# Altium project UD-CPU_DIN.PrjPcb
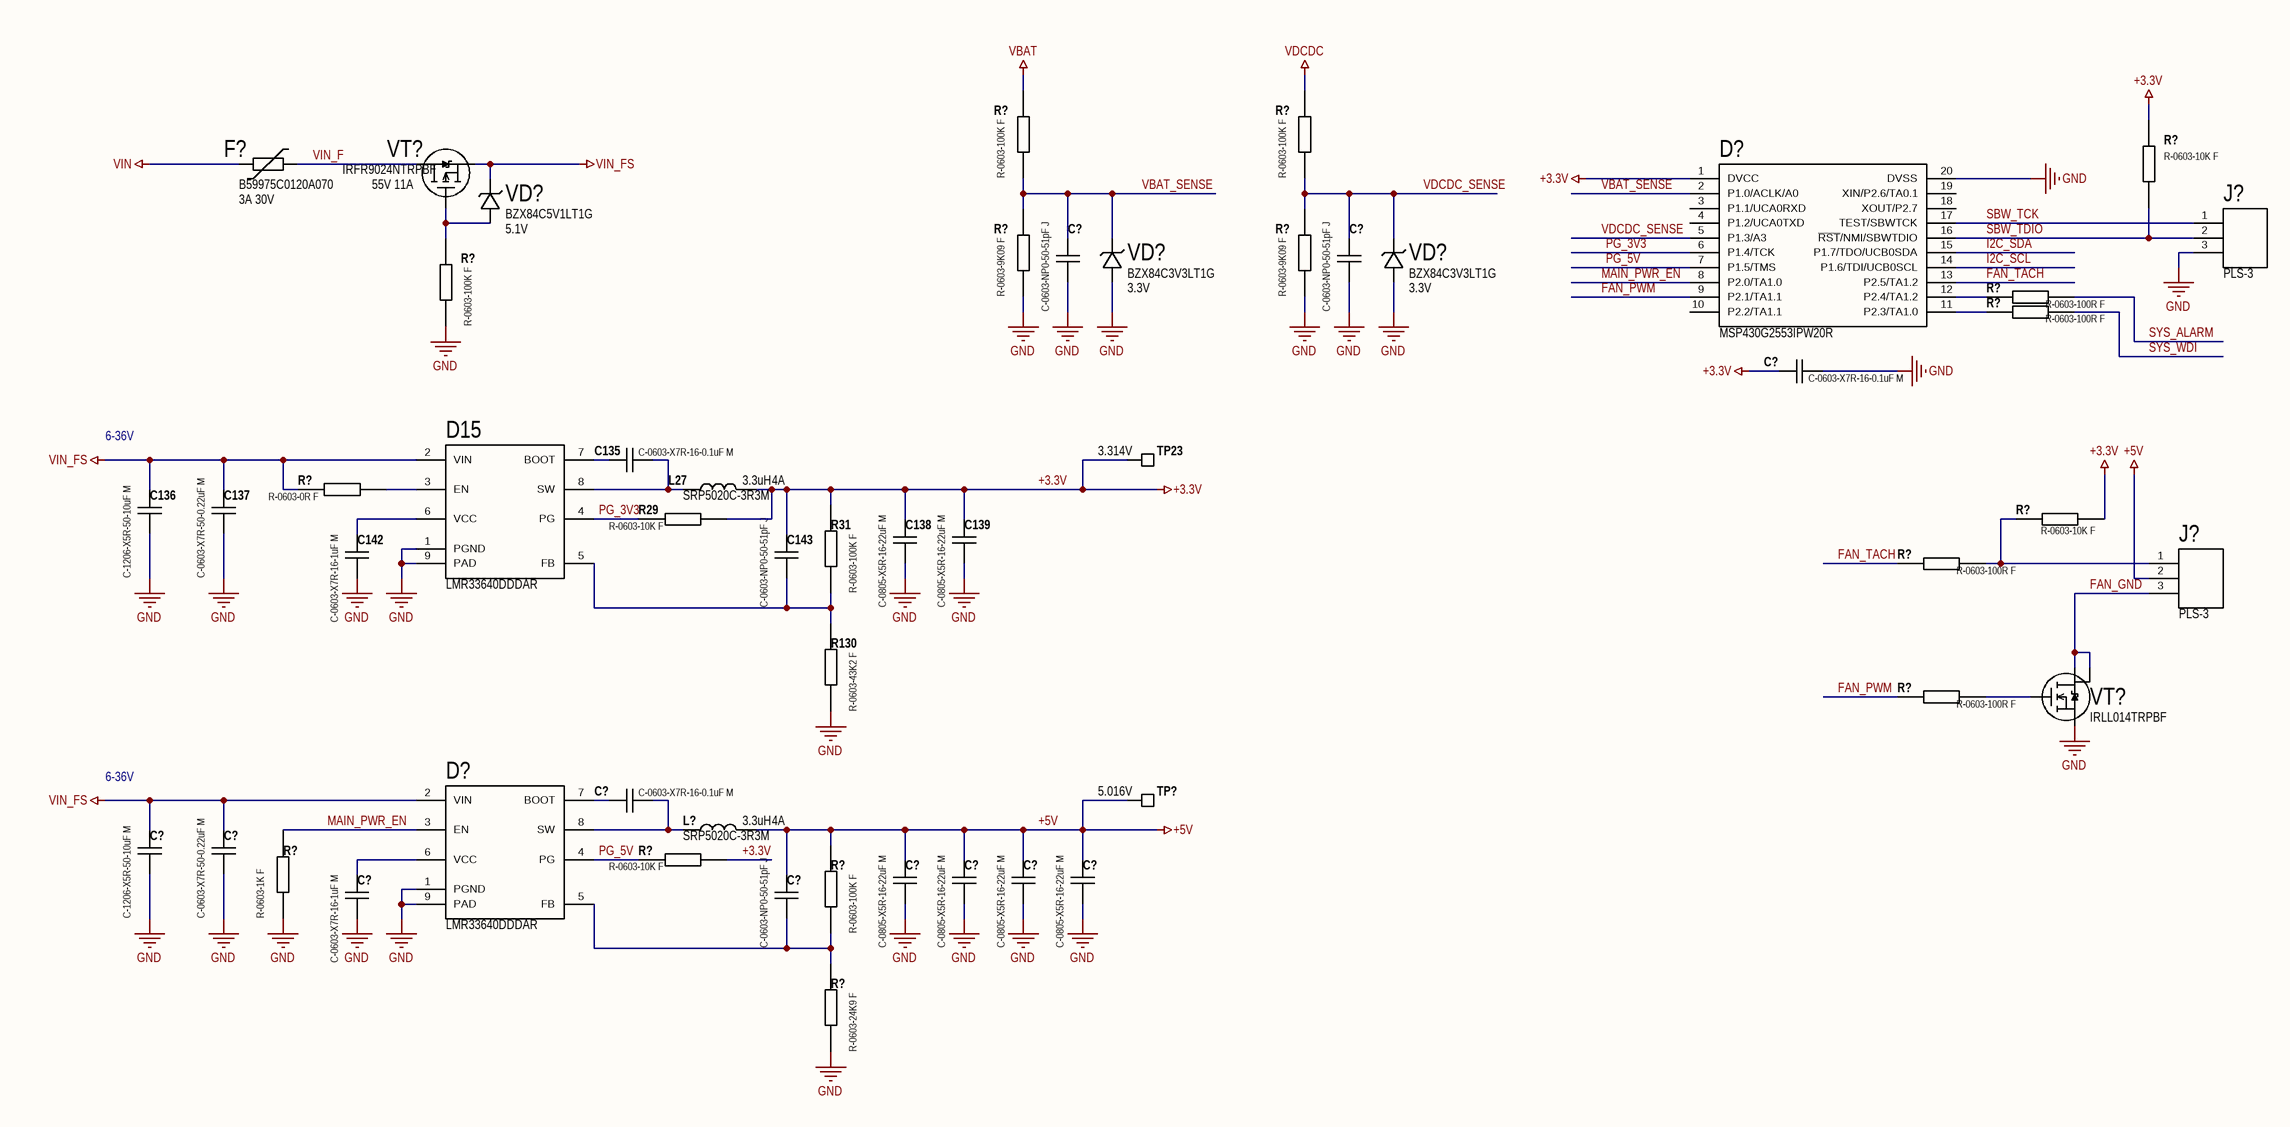
[diagram p0: 1-POWER.SchDoc]
GlobalProjectName: UD-CPU-DIN Main; GlobalProjectRevision: 2.0
4 sheets, 123 parts. Net scope: global (net labels, ports and power ports of the same name join across sheets).
Board file: CPU_DIN_boards_v1_0.PcbDoc
Sheets:
  1-POWER.SchDoc
  2-RPI.SchDoc
  3-GPIO.SchDoc
  4-RELAYS.SchDoc

## Sheet 1-POWER.SchDoc
size 420 x 297 mm; Engineer: Иванов; DocumentNumber: POWER; SheetNumber: 1; SheetTotal: 4

### Parts
(Parts that share a designator on the sheet are numbered #1, #2 ... from top to bottom, then left to right.)
C135  C-0603-X7R-16-0.1uF M  [CAPC160X80X100L35N]
C136  C-1206-X5R-50-10uF M  [CAPC320X160X180L50N]
C137  C-0603-X7R-50-0.22uF M  [CAPC160X80X100L35N]
C138  C-0805-X5R-16-22uF M  [CAPC200X125X145L50N]
C139  C-0805-X5R-16-22uF M  [CAPC200X125X145L50N]
C142  C-0603-X7R-16-1uF M  [CAPC160X80X100L35N]
C143  C-0603-NP0-50-51pF J  [CAPC160X80X100L35N]
C?#1  C-0603-NP0-50-51pF J  [CAPC160X80X100L35N]
C?#2  C-0603-NP0-50-51pF J  [CAPC160X80X100L35N]
C?#3  C-0603-X7R-16-0.1uF M  [CAPC160X80X100L35N]
C?#4  C-0603-X7R-16-0.1uF M  [CAPC160X80X100L35N]
C?#5  C-1206-X5R-50-10uF M  [CAPC320X160X180L50N]
C?#6  C-0603-X7R-50-0.22uF M  [CAPC160X80X100L35N]
C?#7  C-0805-X5R-16-22uF M  [CAPC200X125X145L50N]
C?#8  C-0805-X5R-16-22uF M  [CAPC200X125X145L50N]
C?#9  C-0805-X5R-16-22uF M  [CAPC200X125X145L50N]
C?#10  C-0805-X5R-16-22uF M  [CAPC200X125X145L50N]
C?#11  C-0603-X7R-16-1uF M  [CAPC160X80X100L35N]
C?#12  C-0603-NP0-50-51pF J  [CAPC160X80X100L35N]
D15  LMR33640DDDAR  [SOIC9P127_490X600X170L83X41T490X295]
D?#1  MSP430G2553IPW20R
D?#2  LMR33640DDDAR  [SOIC9P127_490X600X170L83X41T490X295]
F?#1  B59975C0120A070  value 3A 30V
J?#1  PLS-3  [HDRV3W63P254_3X1_762X571H1144]
J?#2  PLS-3  [HDRV3W63P254_3X1_762X571H1144]
L27  SRP5020C-3R3M  value 3.3uH  MaxCurrent: 4A  [INDDFN2_570X520X200L110X250_srp5020c]
L?  SRP5020C-3R3M  value 3.3uH  MaxCurrent: 4A  [INDDFN2_570X520X200L110X250_srp5020c]
R29  R-0603-10K F  [RESC160X80X55L30N]
R31  R-0603-100K F  [RESC160X80X55L30N]
R130  R-0603-43K2 F  [RESC160X80X55L30N]
R?#1  R-0603-100K F  [RESC160X80X55L30N]
R?#2  R-0603-100K F  [RESC160X80X55L30N]
R?#3  R-0603-10K F  [RESC160X80X55L30N]
R?#4  R-0603-9K09 F  [RESC160X80X55L30N]
R?#5  R-0603-9K09 F  [RESC160X80X55L30N]
R?#6  R-0603-100K F  [RESC160X80X55L30N]
R?#7  R-0603-100R F  [RESC160X80X55L30N]
R?#8  R-0603-100R F  [RESC160X80X55L30N]
R?#9  R-0603-0R F  [RESC160X80X55L30N]
R?#10  R-0603-10K F  [RESC160X80X55L30N]
R?#11  R-0603-100R F  [RESC160X80X55L30N]
R?#12  R-0603-100R F  [RESC160X80X55L30N]
R?#13  R-0603-1K F  [RESC160X80X55L30N]
R?#14  R-0603-100K F  [RESC160X80X55L30N]
R?#15  R-0603-10K F  [RESC160X80X55L30N]
R?#16  R-0603-24K9 F  [RESC160X80X55L30N]
TP23  Testpoint  [TP_1x1_smd]  (value not drawn)  (no BOM)
TP?  Testpoint  [TP_1x1_smd]  (value not drawn)  (no BOM)
VD?#1  BZX84C5V1LT1G  value 5.1V  [SOT23-3]
VD?#2  BZX84C3V3LT1G  value 3.3V  [SOT23-3]
VD?#3  BZX84C3V3LT1G  value 3.3V  [SOT23-3]
VT?#1  IRFR9024NTRPBF  value 55V 11A
VT?#2  IRLL014TRPBF

### Nets
+3.3V: C138.1 C139.1 C143.1 C?#3.1 D?#1.1(DVCC) L27.2 R29.1 R31.1 R?#3.1 R?#10.2 R?#15.1 TP23.1
+5V: C?#7.1 C?#8.1 C?#9.1 C?#10.1 C?#12.1 J?#2.2 L?.2 R?#14.1 TP?.1
GND: C136.2 C137.2 C138.2 C139.2 C142.2 C?#1.2 C?#2.2 C?#3.2 C?#5.2 C?#6.2 C?#7.2 C?#8.2 C?#9.2 C?#10.2 C?#11.2 D15.1(PGND) D15.9(PAD) D?#1.20(DVSS) D?#2.1(PGND) D?#2.9(PAD) J?#1.3 R130.2 R?#4.2 R?#5.2 R?#6.2 R?#13.2 R?#16.2 VD?#2.1(A) VD?#3.1(A) VT?#2.3(S)
VBAT: R?#1.1
VDCDC: R?#2.1
VIN: F?#1.1
VIN_FS: C136.1 C137.1 C?#5.1 C?#6.1 D15.2(VIN) D?#2.2(VIN) R?#9.2 VD?#1.3(C) VT?#1.3(S)
FAN_GND: J?#2.3 VT?#2.2(D) VT?#2.4(D)
FAN_PWM: D?#1.9(P2.1/TA1.1) R?#12.2
FAN_TACH: D?#1.13(P2.5/TA1.2) R?#11.2
I2C_SCL: D?#1.14(P1.6/TDI/UCB0SCL)
I2C_SDA: D?#1.15(P1.7/TDO/UCB0SDA)
MAIN_PWR_EN: D?#1.8(P2.0/TA1.0) D?#2.3(EN) R?#13.1
PG_3V3: D15.4(PG) D?#1.6(P1.4/TCK) R29.2
PG_5V: D?#1.7(P1.5/TMS) D?#2.4(PG) R?#15.2
SBW_TCK: D?#1.17(TEST/SBWTCK) J?#1.1
SBW_TDIO: D?#1.16(~{RST}/NMI/SBWTDIO) J?#1.2 R?#3.2
SYS_ALARM: R?#7.1
SYS_WDI: R?#8.1
VBAT_SENSE: C?#1.1 D?#1.2(P1.0/ACLK/A0) R?#1.2 R?#4.1 VD?#2.3(C)
VDCDC_SENSE: C?#2.1 D?#1.5(P1.3/A3) R?#2.2 R?#5.1 VD?#3.3(C)
VIN_F: F?#1.2 VT?#1.4(D)
NetC135_1: C135.1 D15.7(BOOT)
NetC135_2: C135.2 D15.8(SW) L27.1
NetC142_1: C142.1 D15.6(VCC)
NetC143_2: C143.2 D15.5(FB) R31.2 R130.1
NetC?#4_1: C?#4.1 D?#2.7(BOOT)
NetC?#4_2: C?#4.2 D?#2.8(SW) L?.1
NetC?#11_1: C?#11.1 D?#2.6(VCC)
NetC?#12_2: C?#12.2 D?#2.5(FB) R?#14.2 R?#16.1
NetD15_3: D15.3(EN) R?#9.1
NetD?#1_11: D?#1.11(P2.3/TA1.0) R?#8.2
NetD?#1_12: D?#1.12(P2.4/TA1.2) R?#7.2
NetJ?#2_1: J?#2.1 R?#10.1 R?#11.1
NetR?#6_1: R?#6.1 VD?#1.1(A) VT?#1.1(G)
NetR?#12_1: R?#12.1 VT?#2.1(G)

Not connected (* = marked no-connect by the designer): D?#1 3(P1.1/UCA0RXD) 4(P1.2/UCA0TXD) 10(P2.2/TA1.1) 18(XOUT/P2.7) 19(XIN/P2.6/TA0.1)

### Notes on the sheet
- 6-36V
- (near TP23) 3.314V
- (near TP?) 5.016V
- Подп. и дата
- Инв.№ дубл.
- Взам.инв.№
- Подп.и дата
- Инв.№ подл.
- Изм.
- Лист
- № докум.
- Подп.
- Дата
- Копировал
- Формат  A3

### Library data of the parts
C135 C?#3 C?#4 = C: General capacitor; Manufacturer: Murata; Component_Type: Конденсатор; Mount_Type: SMD; Tolerance: 20%; Voltage: 16V; Value: 0.1uF; TC: X7R; Partnumber: *; PnP_Name: C-0603-X7R-16-0.1uF M; Size: 0603; UID: C-0603-X7R-16-0.1uF M
C136 C?#5 = C: General capacitor; Manufacturer: Samsung; Partnumber: CL31A106MBHNNNE; Component_Type: Конденсатор; Mount_Type: Auto; Tolerance: 20%; Voltage: 50V; Value: 10uF; TC: X5R; PnP_Name: C-1206-X5R-50-10uF M; Size: 1206; UID: C-1206-X5R-50-10uF M
C137 C?#6 = C: General capacitor; Manufacturer: Murata; Component_Type: Конденсатор; Mount_Type: SMD; Tolerance: 20%; Voltage: 50V; Value: 0.22uF; TC: X7R; Partnumber: *; PnP_Name: C-0603-X7R-50-0.22uF M; Size: 0603; UID: C-0603-X7R-50-0.22uF M
C138 C139 C?#7-C?#10 = C: General capacitor; Manufacturer: Murata; Component_Type: Конденсатор; Mount_Type: Auto; Tolerance: 20%; Voltage: 16V; Value: 22uF; TC: X5R; Partnumber: *; PnP_Name: C-0805-X5R-16-22uF M; Size: 0805; UID: C-0805-X5R-16-22uF M
C142 C?#11 = C: General capacitor; Manufacturer: Murata; Component_Type: Конденсатор; Mount_Type: Auto; Tolerance: 20%; Voltage: 16V; Value: 1uF; TC: X7R; Partnumber: *; PnP_Name: C-0603-X7R-16-1uF M; Size: 0603; UID: C-0603-X7R-16-1uF M
C143 C?#1 C?#2 C?#12 = C: General capacitor; Manufacturer: Murata; Component_Type: Конденсатор; Mount_Type: Auto; Tolerance: 5%; Voltage: 50V; Value: 51pF; TC: NP0; Partnumber: *; PnP_Name: C-0603-NP0-50-51pF J; Size: 0603; UID: C-0603-NP0-50-51pF J
D15 D?#2 = LMR33640: Buck Switching Regulator IC Positive Adjustable 1V 1 Output 4A; Manufacturer: Texas Instruments; Component_Type: Микросхема; Mount_Type: Auto; PnP_Name: D-LMR33640DDDAR; Partnumber: LMR33640DDDAR; UID: D-LMR33640DDDAR
D?#1 = MSP430G2553IPW20R: 16-bit microcontroller; Manufacturer: Texas Instruments; Component_Type: Микросхема; Mount_Type: Auto; PnP_Name: D-MSP430G2553IPW20R; Partnumber: MSP430G2553IPW20R; UID: D-MSP430G2553IPW20R
F?#1 = R_T: Multifuse; Manufacturer: EPCOS; Mount_Type: Auto; Component_Type: Предохранитель; PnP_Name: F-B59975C0120A070; Partnumber: B59975C0120A070; Tolerance: -; Size: -; UID: F-B59975C0120A070; TC: -
J?#1 J?#2 = Conn_3: Manufacturer: KLS; Component_Type: Разъём; Mount_Type: Manual; Partnumber: PLS-3; UID: X-PLS-3
L27 L? = L: General inductor; Manufacturer: Bourns Inc.; Mount_Type: Auto; Component_Type: Дроссель; PnP_Name: L-SRP5020C-3R3M; Tolerance: 20%; DC Resistance: 74mOhm; Partnumber: SRP5020C-3R3M; Size: 5.7x5.2mm; UID: L-SRP5020C-3R3M
R29 R?#3 R?#10 R?#15 = R: General resistor; Manufacturer: Yageo; Mount_Type: Auto; Component_Type: Резистор; Tolerance: 1%; Value: 10k; Partnumber: *; Size: 0603; PnP_Name: R-0603-10K F; UID: R-0603-10K F
R31 R?#1 R?#2 R?#6 R?#14 = R: General resistor; Manufacturer: Yageo; Mount_Type: Auto; Component_Type: Резистор; Tolerance: 1%; Value: 100k; Partnumber: *; Size: 0603; PnP_Name: R-0603-100K F; UID: R-0603-100K F
R130 = R: General resistor; Manufacturer: Yageo; Mount_Type: Auto; Component_Type: Резистор; Tolerance: 1%; Value: 43.2k; Partnumber: *; Size: 0603; PnP_Name: R-0603-43K2 F; UID: R-0603-43K2 F
R?#4 R?#5 = R: General resistor; Manufacturer: Yageo; Mount_Type: Auto; Component_Type: Резистор; Tolerance: 1%; Value: 9.09k; Partnumber: *; Size: 0603; PnP_Name: R-0603-9K09 F; UID: R-0603-9K09 F
R?#7 R?#8 R?#11 R?#12 = R: General resistor; Manufacturer: Yageo; Mount_Type: SMD; Component_Type: Резистор; Value: 100; Partnumber: *; Tolerance: -; Size: 0603; PnP_Name: R-0603-100R F; UID: R-0603-100R F
R?#9 = R: General resistor; Manufacturer: Yageo; Mount_Type: SMD; Component_Type: Резистор; Value: 0; Partnumber: *; Tolerance: -; Size: 0603; PnP_Name: R-0603-0R F; UID: R-0603-0R F
R?#13 = R: General resistor; Manufacturer: Yageo; Mount_Type: Auto; Component_Type: Резистор; Tolerance: 1%; Value: 1k; Partnumber: *; Size: 0603; PnP_Name: R-0603-1K F; UID: R-0603-1K F
R?#16 = R: General resistor; Manufacturer: Yageo; Mount_Type: Auto; Component_Type: Резистор; Tolerance: 1%; Value: 24.9k; Partnumber: *; Size: 0603; PnP_Name: R-0603-24K9 F; UID: R-0603-24K9 F
TP23 TP? = Test_point: Test point
VD?#1 = BZX84C5V1LT1G: Zener Voltage Regulator (Diod); Manufacturer: ON Semiconductor; Component_Type: Транзистор; Mount_Type: Auto; PnP_Name: VD-BZX84C5V1LT1G; Partnumber: BZX84C5V1LT1G; UID: VD-BZX84C5V1LT1G
VD?#2 VD?#3 = BZX84C5V1LT1G: Zener Voltage Regulator (Diod); Manufacturer: ON Semiconductor; Component_Type: Транзистор; Mount_Type: Auto; PnP_Name: VD-BZX84C3V3LT1G; Partnumber: BZX84C3V3LT1G; UID: VD-BZX84C3V3LT1G
VT?#1 = IRFR9024: MOSFET P-CH 55V 11A DPAK; Manufacturer: Infineon Technologies; Component_Type: Транзистор; Mount_Type: Auto; PnP_Name: VT-IRFR9024NTRPBF; Partnumber: IRFR9024NTRPBF; UID: VT-IRFR9024NTRPBF
VT?#2 = IRLL014: Power N-MOSFET; Manufacturer: Vishay; Component_Type: Транзистор; Mount_Type: Auto; PnP_Name: VT-IRLL014TRPBF; Value: 60V 2.7A; Partnumber: IRLL014TRPBF; UID: VT-IRLL014TRPBF

## Sheet 2-RPI.SchDoc
size 420 x 297 mm; Engineer: Иванов; DocumentNumber: CONNECTORS; SheetNumber: 2; SheetTotal: 4
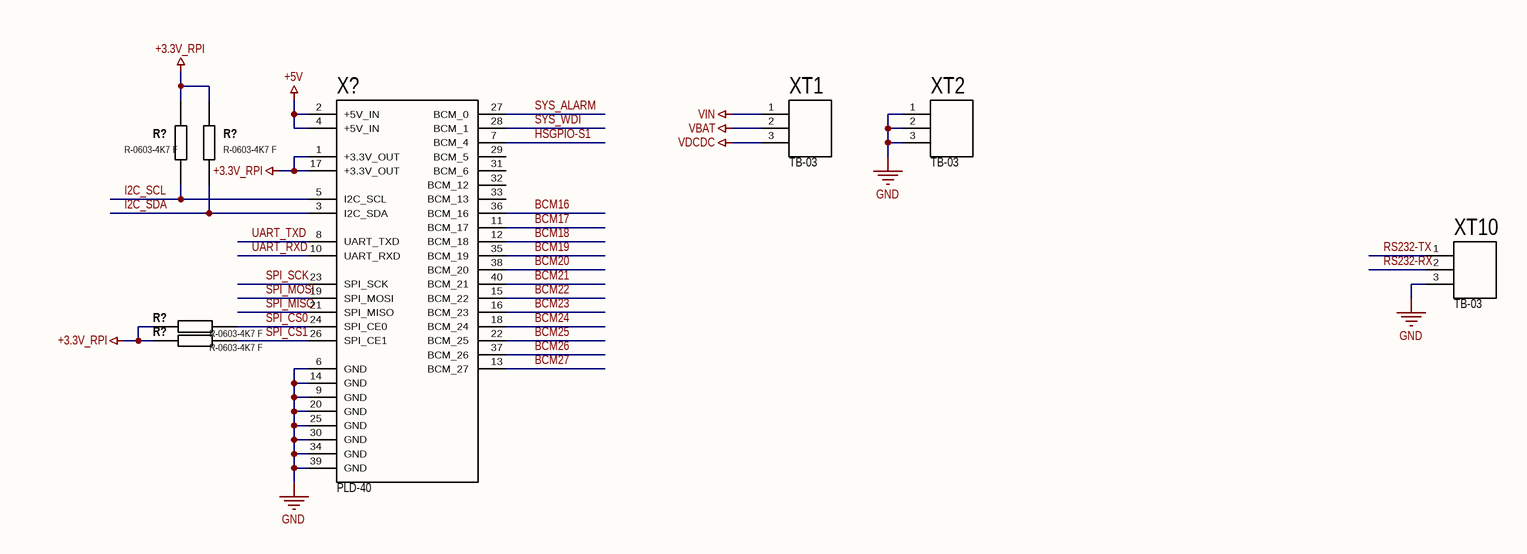
[diagram p1: 2-RPI.SchDoc]

### Parts
(Parts that share a designator on the sheet are numbered #1, #2 ... from top to bottom, then left to right.)
R?#17  R-0603-4K7 F  [RESC160X80X55L30N]
R?#18  R-0603-4K7 F  [RESC160X80X55L30N]
R?#19  R-0603-4K7 F  [RESC160X80X55L30N]
R?#20  R-0603-4K7 F  [RESC160X80X55L30N]
X?  PLD-40
XT1  TB-03  [HDRV3W63P254_3X1_762X571H1144]
XT2  TB-03  [HDRV3W63P254_3X1_762X571H1144]
XT10  TB-03  [HDRV3W63P254_3X1_762X571H1144]

### Nets
+3.3V_RPI: R?#17.2 R?#18.2 R?#19.2 R?#20.2 X?.1(+3.3V_OUT) X?.17(+3.3V_OUT)
+5V: X?.2(+5V_IN) X?.4(+5V_IN)
GND: X?.6(GND) X?.9(GND) X?.14(GND) X?.20(GND) X?.25(GND) X?.30(GND) X?.34(GND) X?.39(GND) XT2.1 XT2.2 XT2.3 XT10.3
VBAT: XT1.2
VDCDC: XT1.3
VIN: XT1.1
BCM16: X?.36(BCM_16)
BCM17: X?.11(BCM_17)
BCM18: X?.12(BCM_18)
BCM19: X?.35(BCM_19)
BCM20: X?.38(BCM_20)
BCM21: X?.40(BCM_21)
BCM22: X?.15(BCM_22)
BCM23: X?.16(BCM_23)
BCM24: X?.18(BCM_24)
BCM25: X?.22(BCM_25)
BCM26: X?.37(BCM_26)
BCM27: X?.13(BCM_27)
HSGPIO-S1: X?.7(BCM_4)
I2C_SCL: R?#17.1 X?.5(I2C_SCL)
I2C_SDA: R?#18.1 X?.3(I2C_SDA)
RS232-RX: XT10.2
RS232-TX: XT10.1
SPI_CS0: R?#19.1 X?.24(SPI_CE0)
SPI_CS1: R?#20.1 X?.26(SPI_CE1)
SPI_MISO: X?.21(SPI_MISO)
SPI_MOSI: X?.19(SPI_MOSI)
SPI_SCK: X?.23(SPI_SCK)
SYS_ALARM: X?.27(BCM_0)
SYS_WDI: X?.28(BCM_1)
UART_RXD: X?.10(UART_RXD)
UART_TXD: X?.8(UART_TXD)

Not connected (* = marked no-connect by the designer): X? 29(BCM_5) 31(BCM_6) 32(BCM_12) 33(BCM_13)

### Notes on the sheet
- Подп. и дата
- Инв.№ дубл.
- Взам.инв.№
- Подп.и дата
- Инв.№ подл.
- Изм.
- Лист
- № докум.
- Подп.
- Дата
- Копировал
- Формат  A3

### Library data of the parts
R?#17-R?#20 = R: General resistor; Manufacturer: Yageo; Mount_Type: Auto; Component_Type: Резистор; Tolerance: 1%; Value: 4.7k; Partnumber: *; Size: 0603; PnP_Name: R-0603-4K7 F; UID: R-0603-4K7 F
X? = Conn_2x20_RPI: Manufacturer: KLS; Component_Type: Разъём; Mount_Type: Manual; Partnumber: PLD-40; UID: X-PLD-40
XT1 XT2 XT10 = Conn_3: Manufacturer: KLS; Component_Type: Клеммник; Mount_Type: Manual; Partnumber: TB-03; UID: X-TB-03

## Sheet 3-GPIO.SchDoc
size 420 x 297 mm; Engineer: Иванов; DocumentNumber: GPIO; SheetNumber: 3; SheetTotal: 4
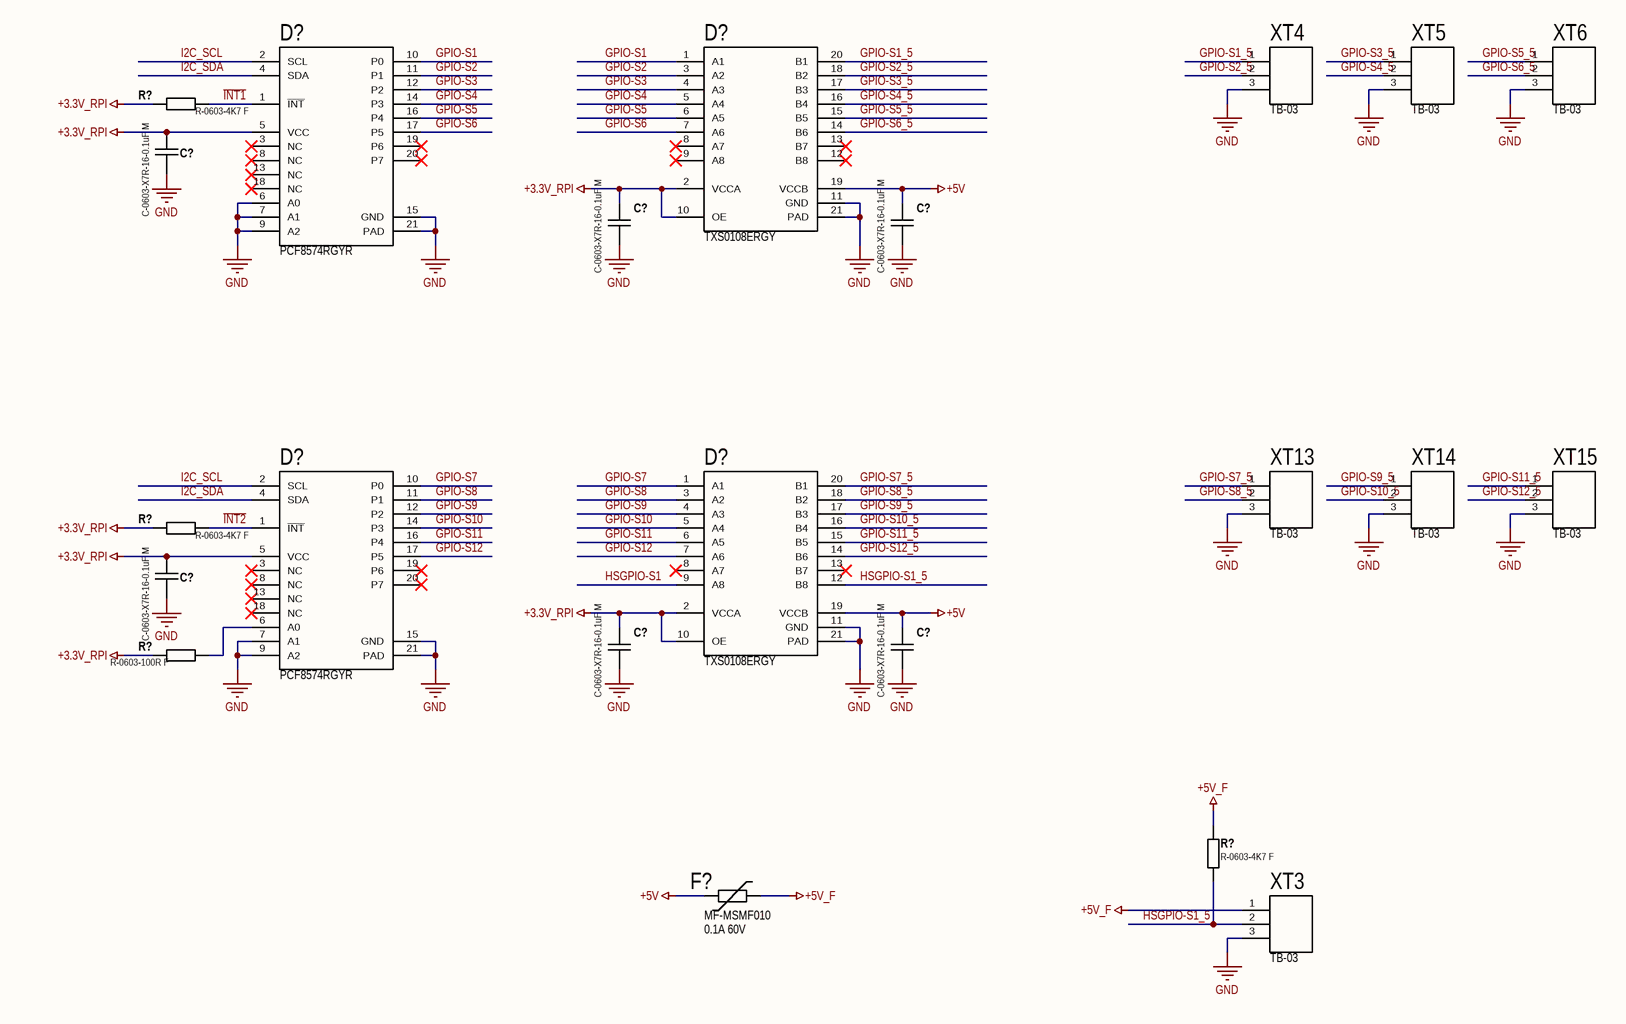
[diagram p2: 3-GPIO.SchDoc]

### Parts
(Parts that share a designator on the sheet are numbered #1, #2 ... from top to bottom, then left to right.)
C?#13  C-0603-X7R-16-0.1uF M  [CAPC160X80X100L35N]
C?#14  C-0603-X7R-16-0.1uF M  [CAPC160X80X100L35N]
C?#15  C-0603-X7R-16-0.1uF M  [CAPC160X80X100L35N]
C?#16  C-0603-X7R-16-0.1uF M  [CAPC160X80X100L35N]
C?#17  C-0603-X7R-16-0.1uF M  [CAPC160X80X100L35N]
C?#18  C-0603-X7R-16-0.1uF M  [CAPC160X80X100L35N]
D?#3  PCF8574RGYR
D?#4  TXS0108ERGY  [QFN21P50_450X350X100L40X24T305X205N]
D?#5  PCF8574RGYR
D?#6  TXS0108ERGY  [QFN21P50_450X350X100L40X24T305X205N]
F?#2  MF-MSMF010  value 0.1A 60V
R?#21  R-0603-4K7 F  [RESC160X80X55L30N]
R?#22  R-0603-4K7 F  [RESC160X80X55L30N]
R?#23  R-0603-100R F  [RESC160X80X55L30N]
R?#24  R-0603-4K7 F  [RESC160X80X55L30N]
XT3  TB-03  [HDRV3W63P254_3X1_762X571H1144]
XT4  TB-03  [HDRV3W63P254_3X1_762X571H1144]
XT5  TB-03  [HDRV3W63P254_3X1_762X571H1144]
XT6  TB-03  [HDRV3W63P254_3X1_762X571H1144]
XT13  TB-03  [HDRV3W63P254_3X1_762X571H1144]
XT14  TB-03  [HDRV3W63P254_3X1_762X571H1144]
XT15  TB-03  [HDRV3W63P254_3X1_762X571H1144]

### Nets
+3.3V_RPI: C?#13.1 C?#14.1 C?#16.1 C?#17.1 D?#3.5(VCC) D?#4.2(VCCA) D?#4.10(OE) D?#5.5(VCC) D?#6.2(VCCA) D?#6.10(OE) R?#21.2 R?#22.2 R?#23.2
+5V: C?#15.1 C?#18.1 D?#4.19(VCCB) D?#6.19(VCCB) F?#2.1
+5V_F: F?#2.2 R?#24.1 XT3.1
GND: C?#13.2 C?#14.2 C?#15.2 C?#16.2 C?#17.2 C?#18.2 D?#3.6(A0) D?#3.7(A1) D?#3.9(A2) D?#3.15(GND) D?#3.21(PAD) D?#4.11(GND) D?#4.21(PAD) D?#5.7(A1) D?#5.9(A2) D?#5.15(GND) D?#5.21(PAD) D?#6.11(GND) D?#6.21(PAD) XT3.3 XT4.3 XT5.3 XT6.3 XT13.3 XT14.3 XT15.3
GPIO-S1: D?#3.10(P0) D?#4.1(A1)
GPIO-S1_5: D?#4.20(B1) XT4.1
GPIO-S2: D?#3.11(P1) D?#4.3(A2)
GPIO-S2_5: D?#4.18(B2) XT4.2
GPIO-S3: D?#3.12(P2) D?#4.4(A3)
GPIO-S3_5: D?#4.17(B3) XT5.1
GPIO-S4: D?#3.14(P3) D?#4.5(A4)
GPIO-S4_5: D?#4.16(B4) XT5.2
GPIO-S5: D?#3.16(P4) D?#4.6(A5)
GPIO-S5_5: D?#4.15(B5) XT6.1
GPIO-S6: D?#3.17(P5) D?#4.7(A6)
GPIO-S6_5: D?#4.14(B6) XT6.2
GPIO-S7: D?#5.10(P0) D?#6.1(A1)
GPIO-S7_5: D?#6.20(B1) XT13.1
GPIO-S8: D?#5.11(P1) D?#6.3(A2)
GPIO-S8_5: D?#6.18(B2) XT13.2
GPIO-S9: D?#5.12(P2) D?#6.4(A3)
GPIO-S9_5: D?#6.17(B3) XT14.1
GPIO-S10: D?#5.14(P3) D?#6.5(A4)
GPIO-S10_5: D?#6.16(B4) XT14.2
GPIO-S11: D?#5.16(P4) D?#6.6(A5)
GPIO-S11_5: D?#6.15(B5) XT15.1
GPIO-S12: D?#5.17(P5) D?#6.7(A6)
GPIO-S12_5: D?#6.14(B6) XT15.2
HSGPIO-S1: D?#6.9(A8)
HSGPIO-S1_5: D?#6.12(B8) R?#24.2 XT3.2
I2C_SCL: D?#3.2(SCL) D?#5.2(SCL)
I2C_SDA: D?#3.4(SDA) D?#5.4(SDA)
~{INT1}: D?#3.1(~{INT}) R?#21.1
~{INT2}: D?#5.1(~{INT}) R?#22.1
NetD?#5_6: D?#5.6(A0) R?#23.1

Not connected (* = marked no-connect by the designer): D?#3 3(NC)* 8(NC)* 13(NC)* 18(NC)* 19(P6)* 20(P7)*; D?#4 8(A7)* 9(A8)* 12(B8)* 13(B7)*; D?#5 3(NC)* 8(NC)* 13(NC)* 18(NC)* 19(P6)* 20(P7)*; D?#6 8(A7)* 13(B7)*

### Notes on the sheet
- Подп. и дата
- Инв.№ дубл.
- Взам.инв.№
- Подп.и дата
- Инв.№ подл.
- Изм.
- Лист
- № докум.
- Подп.
- Дата
- Копировал
- Формат  A3

### Library data of the parts
C?#13-C?#18 = C: as C135 on sheet 1-POWER; Partnumber: *; PnP_Name: C-0603-X7R-16-0.1uF M; Size: 0603; UID: C-0603-X7R-16-0.1uF M
D?#3 D?#5 = PCF8574RGYR: PCF8574 Remote 8-Bit I/O Expander for I2C Bus; Manufacturer: Texas Instruments; Component_Type: Микросхема; Mount_Type: Auto; PnP_Name: D-PCF8574RGYR; Partnumber: PCF8574RGYR; UID: D-PCF8574RGYR
D?#4 D?#6 = TXS0108E: 8-Bit Bi-directional, Level-Shifting, Voltage Translator for Open-Drain and Push-Pull Applications; Manufacturer: Texas Instruments; Component_Type: Микросхема; Mount_Type: Auto; Partnumber: TXS0108ERGY; UID: D-TXS0108ERGY
F?#2 = R_T: Multifuse; Manufacturer: Bourns; Mount_Type: Auto; Component_Type: Предохранитель; PnP_Name: F-MF-MSMF010; Partnumber: MF-MSMF010; Tolerance: -; Size: -; UID: F-MF-MSMF010; TC: -
R?#21 R?#22 R?#24 = R: as R?#17 on sheet 2-RPI; Partnumber: *; Size: 0603; PnP_Name: R-0603-4K7 F; UID: R-0603-4K7 F; TC: -
R?#23 = R: General resistor; Manufacturer: Yageo; Mount_Type: Auto; Component_Type: Резистор; Tolerance: 1%; Value: 100; Partnumber: *; Size: 0603; PnP_Name: R-0603-100R F; UID: R-0603-100R F; TC: -
XT3-XT6 XT13-XT15 = Conn_3: as XT1 on sheet 2-RPI; Partnumber: TB-03; UID: X-TB-03

## Sheet 4-RELAYS.SchDoc
size 420 x 297 mm; Engineer: Иванов; DocumentNumber: GPIO; SheetNumber: 4; SheetTotal: 4
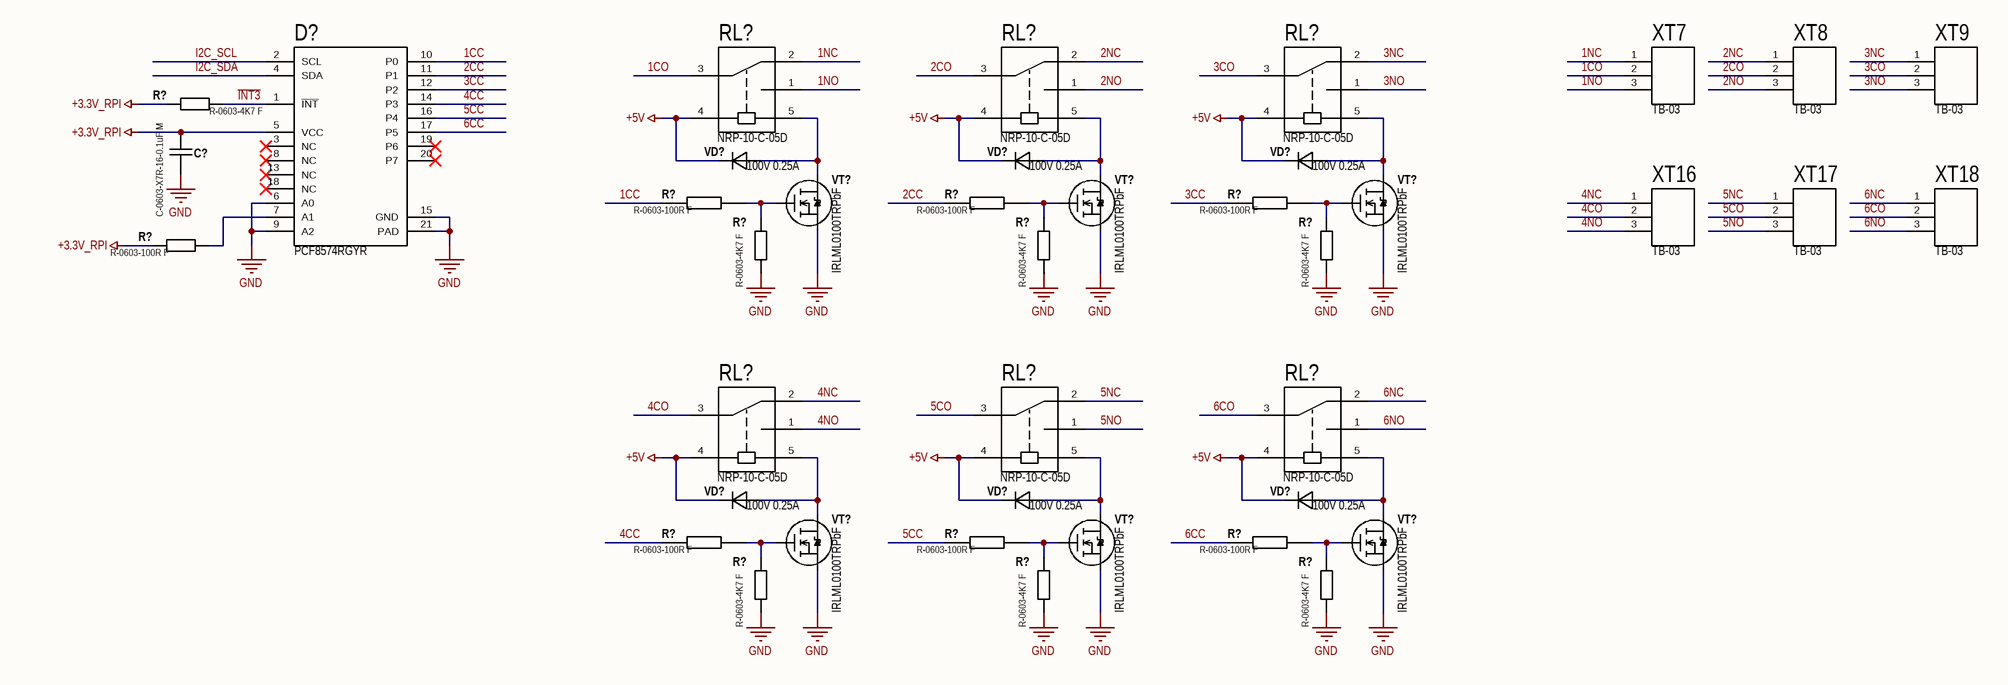
[diagram p3: 4-RELAYS.SchDoc]

### Parts
(Parts that share a designator on the sheet are numbered #1, #2 ... from top to bottom, then left to right.)
C?#19  C-0603-X7R-16-0.1uF M  [CAPC160X80X100L35N]
D?#7  PCF8574RGYR
R?#25  R-0603-4K7 F  [RESC160X80X55L30N]
R?#26  R-0603-100R F  [RESC160X80X55L30N]
R?#27  R-0603-100R F  [RESC160X80X55L30N]
R?#28  R-0603-100R F  [RESC160X80X55L30N]
R?#29  R-0603-100R F  [RESC160X80X55L30N]
R?#30  R-0603-4K7 F  [RESC160X80X55L30N]
R?#31  R-0603-4K7 F  [RESC160X80X55L30N]
R?#32  R-0603-4K7 F  [RESC160X80X55L30N]
R?#33  R-0603-100R F  [RESC160X80X55L30N]
R?#34  R-0603-100R F  [RESC160X80X55L30N]
R?#35  R-0603-100R F  [RESC160X80X55L30N]
R?#36  R-0603-4K7 F  [RESC160X80X55L30N]
R?#37  R-0603-4K7 F  [RESC160X80X55L30N]
R?#38  R-0603-4K7 F  [RESC160X80X55L30N]
RL?#1  NRP-10-C-05D
RL?#2  NRP-10-C-05D
RL?#3  NRP-10-C-05D
RL?#4  NRP-10-C-05D
RL?#5  NRP-10-C-05D
RL?#6  NRP-10-C-05D
VD?#4  value 100V 0.25A  (hidden comment: BAS16J,115)
VD?#5  value 100V 0.25A  (hidden comment: BAS16J,115)
VD?#6  value 100V 0.25A  (hidden comment: BAS16J,115)
VD?#7  value 100V 0.25A  (hidden comment: BAS16J,115)
VD?#8  value 100V 0.25A  (hidden comment: BAS16J,115)
VD?#9  value 100V 0.25A  (hidden comment: BAS16J,115)
VT?#3  IRLML0100TRPbF
VT?#4  IRLML0100TRPbF
VT?#5  IRLML0100TRPbF
VT?#6  IRLML0100TRPbF
VT?#7  IRLML0100TRPbF
VT?#8  IRLML0100TRPbF
XT7  TB-03  [HDRV3W63P254_3X1_762X571H1144]
XT8  TB-03  [HDRV3W63P254_3X1_762X571H1144]
XT9  TB-03  [HDRV3W63P254_3X1_762X571H1144]
XT16  TB-03  [HDRV3W63P254_3X1_762X571H1144]
XT17  TB-03  [HDRV3W63P254_3X1_762X571H1144]
XT18  TB-03  [HDRV3W63P254_3X1_762X571H1144]

### Nets
+3.3V_RPI: C?#19.1 D?#7.5(VCC) R?#25.2 R?#29.2
+5V: RL?#1.4(C+) RL?#2.4(C+) RL?#3.4(C+) RL?#4.4(C+) RL?#5.4(C+) RL?#6.4(C+) VD?#4.3(C) VD?#5.3(C) VD?#6.3(C) VD?#7.3(C) VD?#8.3(C) VD?#9.3(C)
GND: C?#19.2 D?#7.6(A0) D?#7.9(A2) D?#7.15(GND) D?#7.21(PAD) R?#30.1 R?#31.1 R?#32.1 R?#36.1 R?#37.1 R?#38.1 VT?#3.2(S) VT?#4.2(S) VT?#5.2(S) VT?#6.2(S) VT?#7.2(S) VT?#8.2(S)
1CC: D?#7.10(P0) R?#26.2
1CO: RL?#1.3(CO) XT7.2
1NC: RL?#1.2(NC) XT7.1
1NO: RL?#1.1(NO) XT7.3
2CC: D?#7.11(P1) R?#27.2
2CO: RL?#2.3(CO) XT8.2
2NC: RL?#2.2(NC) XT8.1
2NO: RL?#2.1(NO) XT8.3
3CC: D?#7.12(P2) R?#28.2
3CO: RL?#3.3(CO) XT9.2
3NC: RL?#3.2(NC) XT9.1
3NO: RL?#3.1(NO) XT9.3
4CC: D?#7.14(P3) R?#33.2
4CO: RL?#4.3(CO) XT16.2
4NC: RL?#4.2(NC) XT16.1
4NO: RL?#4.1(NO) XT16.3
5CC: D?#7.16(P4) R?#34.2
5CO: RL?#5.3(CO) XT17.2
5NC: RL?#5.2(NC) XT17.1
5NO: RL?#5.1(NO) XT17.3
6CC: D?#7.17(P5) R?#35.2
6CO: RL?#6.3(CO) XT18.2
6NC: RL?#6.2(NC) XT18.1
6NO: RL?#6.1(NO) XT18.3
I2C_SCL: D?#7.2(SCL)
I2C_SDA: D?#7.4(SDA)
~{INT3}: D?#7.1(~{INT}) R?#25.1
NetD?#7_7: D?#7.7(A1) R?#29.1
NetR?#26_1: R?#26.1 R?#30.2 VT?#3.1(G)
NetR?#27_1: R?#27.1 R?#31.2 VT?#4.1(G)
NetR?#28_1: R?#28.1 R?#32.2 VT?#5.1(G)
NetR?#33_1: R?#33.1 R?#36.2 VT?#6.1(G)
NetR?#34_1: R?#34.1 R?#37.2 VT?#7.1(G)
NetR?#35_1: R?#35.1 R?#38.2 VT?#8.1(G)
NetRL?#1_5: RL?#1.5(C-) VD?#4.1(A) VT?#3.3(D)
NetRL?#2_5: RL?#2.5(C-) VD?#5.1(A) VT?#4.3(D)
NetRL?#3_5: RL?#3.5(C-) VD?#6.1(A) VT?#5.3(D)
NetRL?#4_5: RL?#4.5(C-) VD?#7.1(A) VT?#6.3(D)
NetRL?#5_5: RL?#5.5(C-) VD?#8.1(A) VT?#7.3(D)
NetRL?#6_5: RL?#6.5(C-) VD?#9.1(A) VT?#8.3(D)

Not connected (* = marked no-connect by the designer): D?#7 3(NC)* 8(NC)* 13(NC)* 18(NC)* 19(P6)* 20(P7)*

### Notes on the sheet
- Подп. и дата
- Инв.№ дубл.
- Взам.инв.№
- Подп.и дата
- Инв.№ подл.
- Изм.
- Лист
- № докум.
- Подп.
- Дата
- Копировал
- Формат  A3

### Library data of the parts
C?#19 = C: as C135 on sheet 1-POWER; Partnumber: *; PnP_Name: C-0603-X7R-16-0.1uF M; Size: 0603; UID: C-0603-X7R-16-0.1uF M
D?#7 = PCF8574RGYR: as D?#3 on sheet 3-GPIO; Partnumber: PCF8574RGYR; UID: D-PCF8574RGYR
R?#25 R?#30-R?#32 R?#36-R?#38 = R: as R?#17 on sheet 2-RPI; Partnumber: *; Size: 0603; PnP_Name: R-0603-4K7 F; UID: R-0603-4K7 F; TC: -
R?#26-R?#28 R?#33-R?#35 = R: as R?#7 on sheet 1-POWER; Partnumber: *; Tolerance: -; Size: 0603; PnP_Name: R-0603-100R F; UID: R-0603-100R F
R?#29 = R: as R?#23 on sheet 3-GPIO; Partnumber: *; Size: 0603; PnP_Name: R-0603-100R F; UID: R-0603-100R F; TC: -
RL?#1-RL?#6 = NRP-10-C-05D: Relay; Manufacturer: NCR; Component_Type: Реле; Mount_Type: Manual; UID: RL-NRP-10-C-05D; Partnumber: NRP-10-C-05D
VD?#4-VD?#9 = BAS16J_115: Zener Voltage Regulator (Diod); Manufacturer: Nexperia; Component_Type: Транзистор; Mount_Type: Auto; PnP_Name: VD-BAS16J115; Partnumber: BAS16J,115; UID: VD-BAS16J115
VT?#3-VT?#8 = IRLML0100TRPbF: N-MOSFET; Manufacturer: Vishay; Component_Type: Транзистор; Mount_Type: Auto; PnP_Name: VT-IRLML0100TRPbF; Value: 100V 1.6A; Partnumber: IRLML0100TRPbF; UID: VT-IRLML0100TRPbF
XT7-XT9 XT16-XT18 = Conn_3: as XT1 on sheet 2-RPI; Partnumber: TB-03; UID: X-TB-03

## Nets that join several sheets
+3.3V_RPI: 2-RPI (6 pins), 3-GPIO (13 pins), 4-RELAYS (C?#19.1 D?#7.5 R?#25.2 R?#29.2)
+5V: 1-POWER (9 pins), 2-RPI (X?.2 X?.4), 3-GPIO (5 pins), 4-RELAYS (12 pins)
GND: 1-POWER (30 pins), 2-RPI (12 pins), 3-GPIO (26 pins), 4-RELAYS (17 pins)
VBAT: 1-POWER (R?#1.1), 2-RPI (XT1.2)
VDCDC: 1-POWER (R?#2.1), 2-RPI (XT1.3)
VIN: 1-POWER (F?#1.1), 2-RPI (XT1.1)
HSGPIO-S1: 2-RPI (X?.7), 3-GPIO (D?#6.9)
I2C_SCL: 1-POWER (D?#1.14), 2-RPI (R?#17.1 X?.5), 3-GPIO (D?#3.2 D?#5.2), 4-RELAYS (D?#7.2)
I2C_SDA: 1-POWER (D?#1.15), 2-RPI (R?#18.1 X?.3), 3-GPIO (D?#3.4 D?#5.4), 4-RELAYS (D?#7.4)
SYS_ALARM: 1-POWER (R?#7.1), 2-RPI (X?.27)
SYS_WDI: 1-POWER (R?#8.1), 2-RPI (X?.28)